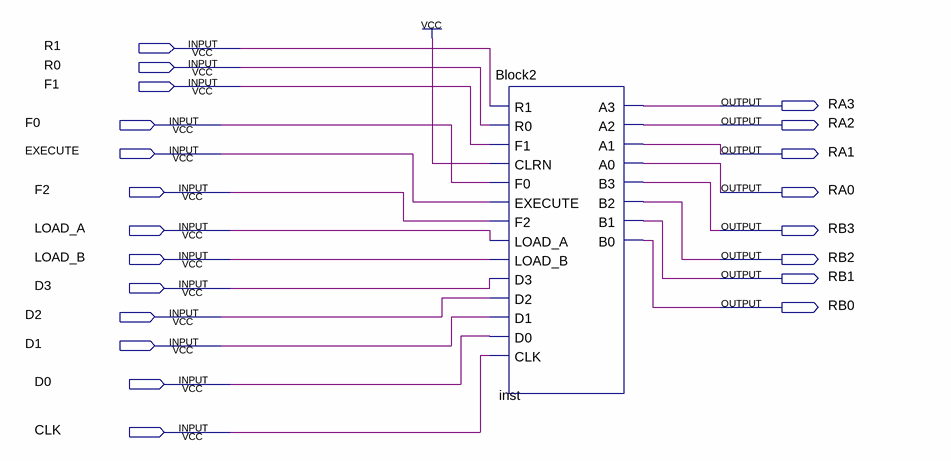
[diagram p0: schematic sheet]
// Quartus schematic FINAL.bdf as structural Verilog: 1 symbols, 21 pins
module FINAL (
  input  R1,
  input  R0,
  input  F1,
  input  F0,
  input  EXECUTE,
  input  F2,
  input  LOAD_A,
  input  LOAD_B,
  input  D3,
  input  D2,
  input  D1,
  input  D0,
  input  CLK,
  output RA3,
  output RA2,
  output RA1,
  output RA0,
  output RB3,
  output RB2,
  output RB1,
  output RB0
);

  Block2 inst (
    .R1(R1), .R0(R0), .F1(F1), .CLRN(1'b1), .F0(F0), .EXECUTE(EXECUTE), .F2(F2), .LOAD_A(LOAD_A),
    .LOAD_B(LOAD_B), .D3(D3), .D2(D2), .D1(D1), .D0(D0), .CLK(CLK), .A3(RA3), .A2(RA2), .A1(RA1), .A0(RA0),
    .B3(RB3), .B2(RB2), .B1(RB1), .B0(RB0));
endmodule
